# EAGLE design penvmon (EAGLE 9.6.2)
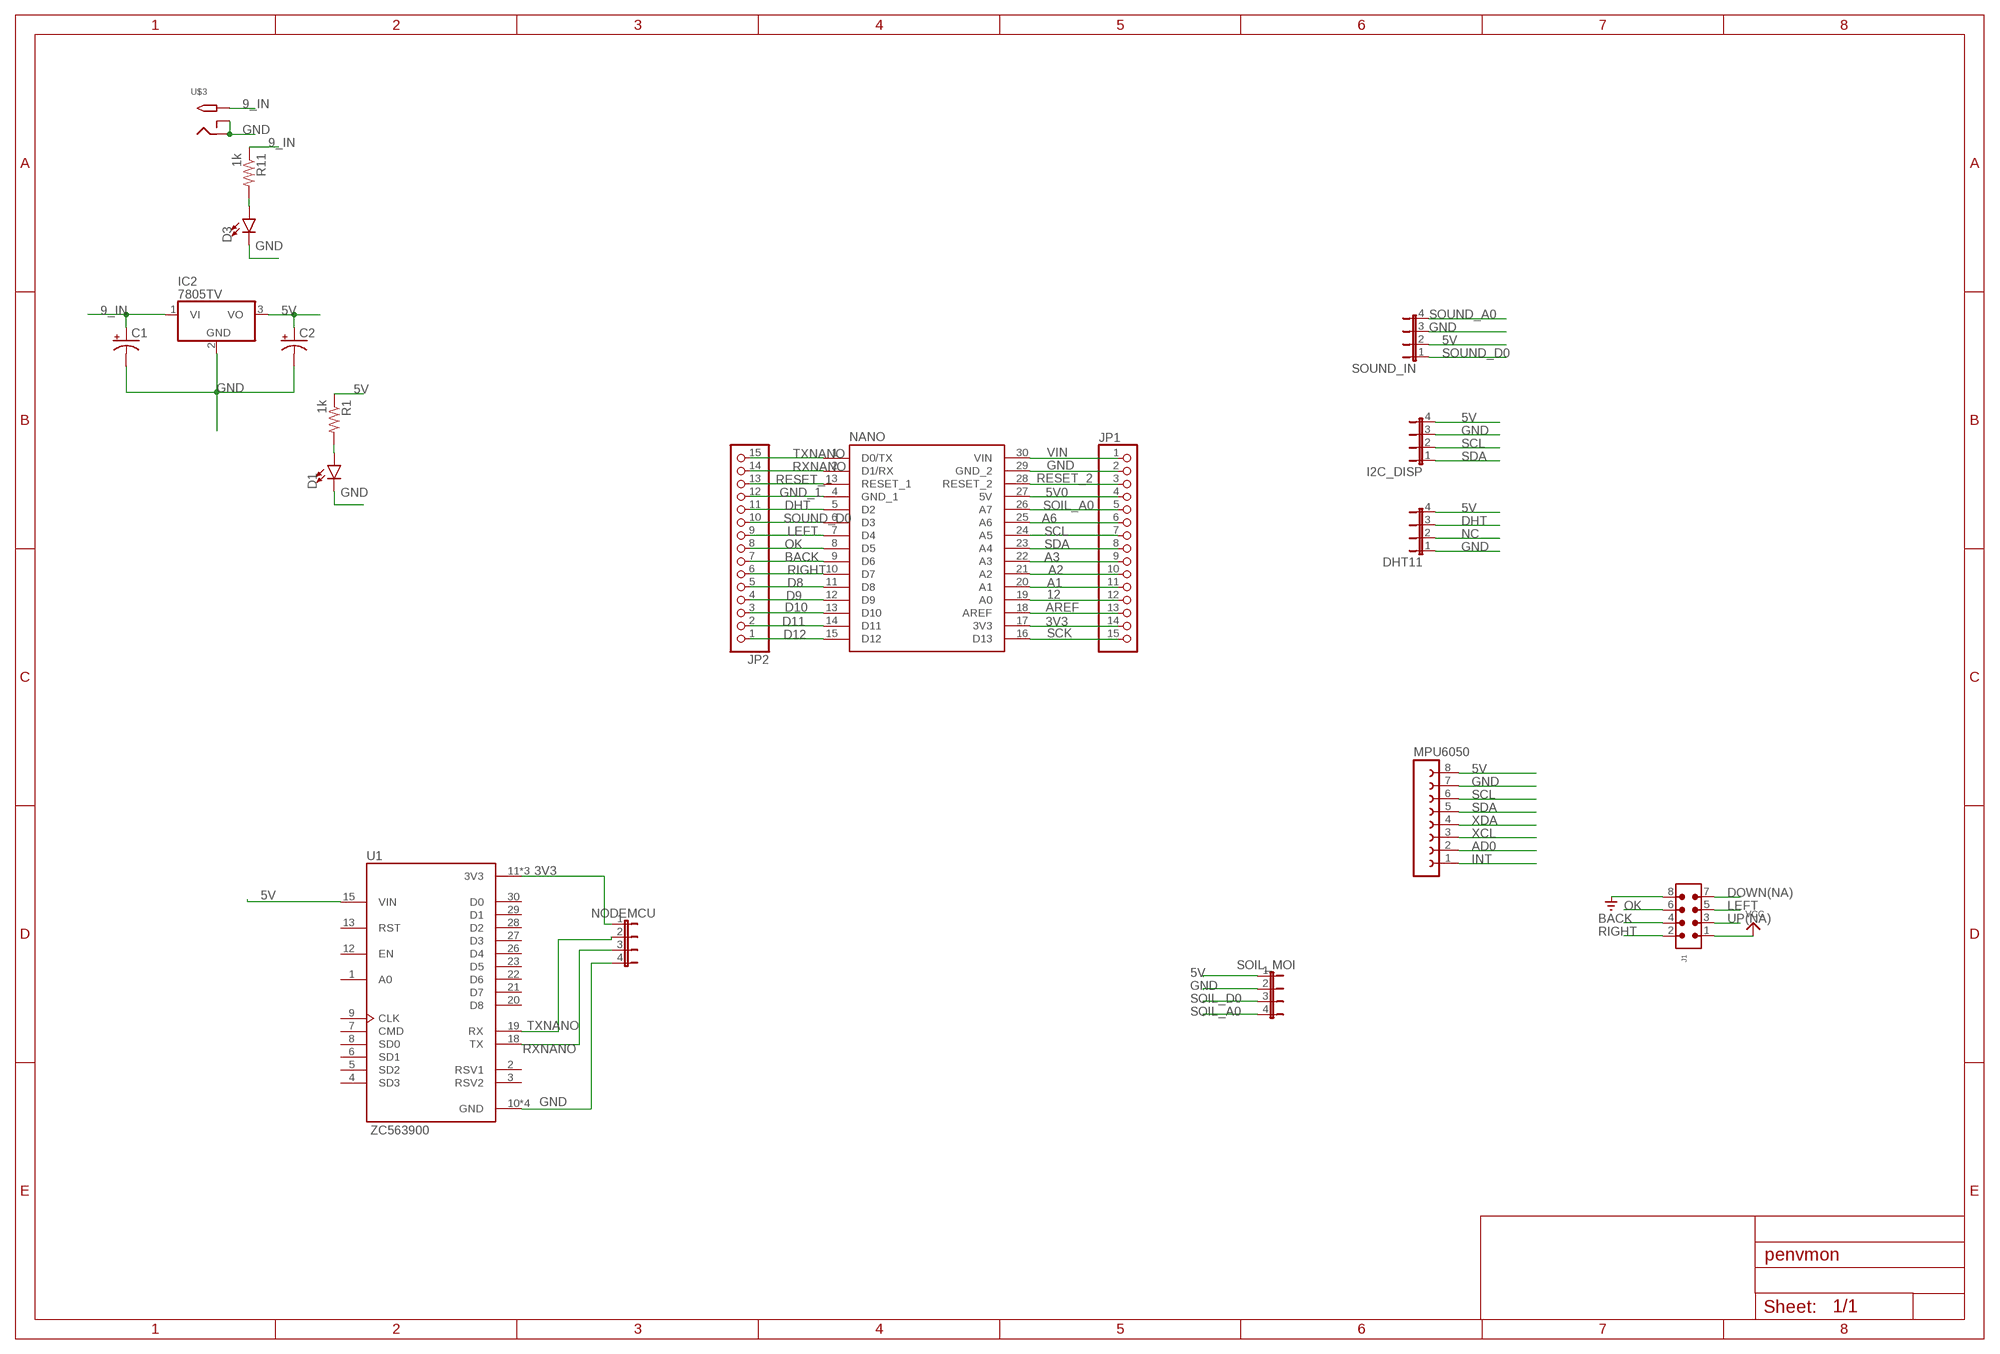
[diagram p0: schematic, sheet 1]

## Parts
C1  CPOL-USE3.5-8  [E3,5-8]
C2  CPOL-USE3.5-8  [E3,5-8]
D1  LED3MM  [LED_3MM]
D3  LED3MM  [LED_3MM]
DHT11  JP4E  [JP4]
I2C_DISP  JP4E  [JP4]
IC2  7805TV  [TO220V]
J1  6120XX21621_61200821621  [61200821621]
JP1  PINHD-1X15  [1X15]
JP2  PINHD-1X15  [1X15]
MPU6050  FE08-1  [FE08]
NANO  A000005  [MODULE_A000005]
NODEMCU  JP4E  [JP4]
R1  1k  R-US_M0805  [M0805]
R11  1k  R-US_M0805  [M0805]
SOIL_MOI  JP4E  [JP4]
SOUND_IN  JP4E  [JP4]
U1  ZC563900  [MODULE_ZC563900]
U$3  2.1MMJACKTHM  [PJ-102A]

## Nets
3V3: JP1.14 NANO.17(3V3) NODEMCU.1 U1.11(3V3) U1.16(3V3) U1.25(3V3)
5V: C2.+ DHT11.4 I2C_DISP.4 IC2.3(VO) MPU6050.8 R1.1 SOIL_MOI.1 SOUND_IN.2 U1.15(VIN)
5V0: JP1.4 NANO.27(5V)
9_IN: C1.+ IC2.1(VI) R11.1 U$3.TIP
12: JP1.12 NANO.19(A0)
A1: JP1.11 NANO.20(A1)
A2: JP1.10 NANO.21(A2)
A3: JP1.9 NANO.22(A3)
A6: JP1.6 NANO.25(A6)
AD0: MPU6050.2
AREF: JP1.13 NANO.18(AREF)
BACK: J1.4 JP2.7 NANO.9(D6)
D8: JP2.5 NANO.11(D8)
D9: JP2.4 NANO.12(D9)
D10: JP2.3 NANO.13(D10)
D11: JP2.2 NANO.14(D11)
D12: JP2.1 NANO.15(D12)
DHT: DHT11.3 JP2.11 NANO.5(D2)
DOWN(NA): J1.7
GND: C1.- C2.- D1.K(C) D3.K(C) DHT11.1 I2C_DISP.3 IC2.2(GND) J1.8 JP1.2 MPU6050.7 NANO.29(GND_2) NODEMCU.4 SOIL_MOI.2 SOUND_IN.3 U1.10(GND) U1.14(GND) U1.17(GND) U1.24(GND) U$3.RING U$3.RING_SW ; supply symbol labelled SUPPLY0_GND_
GND_1: JP2.12 NANO.4(GND_1)
INT: MPU6050.1
LEFT: J1.5 JP2.9 NANO.7(D4)
N$2: D3.A R11.2
N$3: D1.A R1.2
NC: DHT11.2
OK: J1.6 JP2.8 NANO.8(D5)
RESET_1: JP2.13 NANO.3(RESET_1)
RESET_2: JP1.3 NANO.28(RESET_2)
RIGHT: J1.2 JP2.6 NANO.10(D7)
RXNANO: JP2.14 NANO.2(D1/RX) NODEMCU.3 U1.18(TX)
SCK: JP1.15 NANO.16(D13)
SCL: I2C_DISP.2 JP1.7 MPU6050.6 NANO.24(A5)
SDA: I2C_DISP.1 JP1.8 MPU6050.5 NANO.23(A4)
SOIL_A0: JP1.5 NANO.26(A7) SOIL_MOI.4
SOIL_D0: SOIL_MOI.3
SOUND_A0: SOUND_IN.4
SOUND_D0: JP2.10 NANO.6(D3) SOUND_IN.1
TXNANO: JP2.15 NANO.1(D0/TX) NODEMCU.2 U1.19(RX)
UP(NA): J1.3
VCC: J1.1
VIN: JP1.1 NANO.30(VIN)
XCL: MPU6050.3
XDA: MPU6050.4
Unconnected: U1.1(A0) U1.2(RSV1) U1.3(RSV2) U1.4(SD3) U1.5(SD2) U1.6(SD1) U1.7(CMD) U1.8(SD0) U1.9(CLK) U1.12(EN) U1.13(RST) U1.20(D8) U1.21(D7) U1.22(D6) U1.23(D5) U1.26(D4) U1.27(D3) U1.28(D2) U1.29(D1) U1.30(D0)

## Library data of the parts
C1 C2 = adafruit:CPOL-US: POLARIZED CAPACITOR, American symbol
D1 D3 = SparkFun-LED:LED: LED (Generic) Standard schematic elements and footprints for 5mm, 3mm, 1206, and 0603 sized LEDs. Generic LEDs with no color specified.; PROD_ID: DIO-08794
DHT11 I2C_DISP NODEMCU SOIL_MOI SOUND_IN = jumper:JP4E: JUMPER
IC2 = linear:78*: Positive VOLTAGE REGULATOR Source: http://cache.national.com/ds/LM/LM78L05.pdf http://www.fairchildsemi.com/ds/LM/LM7805.pdf
J1 = Wurth_Connectors_WR-BHD:6120XX21621_61200821621: WR-BHD 2.54 mm Male Box Header KIND PROPERTIES: Pitch 2.54 mm Gender:Male MATERIAL PROPERTIES: Insulator Material:PBT Insulator Flammability Rating UL94 V-0 Insulator Color:Black Contact Material :Copper Alloy Contact Plating :Gold Contact Type: Stamped GENERAL INFORMATION: Operating Temperature:-40 °C up to +125 °C Compliance:RoHS Working Voltage: 250 V (AC) Withstanding Voltage:500 V (AC) Contact Resistance: 20 mΩ Insulation Resistance:1000 MΩ CERTIFICATION: UL Approval:E323964 PACKAGING PROPERTIES Packaging :Tray <https://katalog.we-online.com/media/images/v2/o32884v209%20Family_WR-BHD_6120xx21621.jpg> Details see: https://katalog.we-online.com/en/em/BHD_2_54_MALE_BOX_HEADER_6120XX21621 Updated by Yingchun,Shan 2019-10-29 2019 (C) Würth Elektronik; CONTACT-RESISTANCE: 20mOhm; DATASHEET-URL: https://katalog.we-online.com/em/datasheet/61200821621.pdf; GENDER: Male; IR: 3A; L: 17.82mm; MATES: WR-BHD 2.54mm Female IDC Connector with Strain Relief; MOUNT: THT; PACKAGING: Tray; PART-NUMBER: 61200821621; PINS: 8; PITCH: 2.54mm; TOL-R: max.; TYPE: Straight; WORKING-VOLTAGE: 250V(AC)
JP1 JP2 = adafruit:PINHD-1X15: PIN HEADER
MPU6050 = con-lsta:FE08-1: FEMALE HEADER; OC_FARNELL: unknown; OC_NEWARK: unknown
NANO = A000005:A000005: CLOCK SAW OSCILLATOR SEAM7050 T& Check prices <https://pricing.snapeda.com/parts/A000005/Arduino/view-part?ref=eda>; AVAILABILITY: Good; DESCRIPTION: ATmega328 Arduino Nano AVR® ATmega AVR MCU 8-Bit Embedded Evaluation Board; MF: Arduino; MP: A000005; PACKAGE: None; PRICE: None; PURCHASE-URL: https://pricing.snapeda.com/search/part/A000005/?ref=eda
R1 R11 = adafruit:R-US_: RESISTOR, American symbol
U1 = nodemcuZC563900:ZC563900: NodeMcu Lua ESP8266 WIFI Internet of Things Network Development Module Board; AVAILABILITY: Unavailable; DESCRIPTION: NodeMcu Lua ESP8266 WIFI Internet of Things Network Development Module Board; MF: YKS; MP: ZC563900; PACKAGE: None; PRICE: None
U$3 = adafruit:2.1MMJACK: 2.1mm x 5.5mm THM DC jack with internal switch. Digikey part #PJ-102A, 4UCON part #05537 2.1mm x 5.5mm SMT DC jack with internal switch. Digikey part #PJ-002A-SMT, 4UCON part #03267 By microbuilder.eu & adafruit.com

## Board
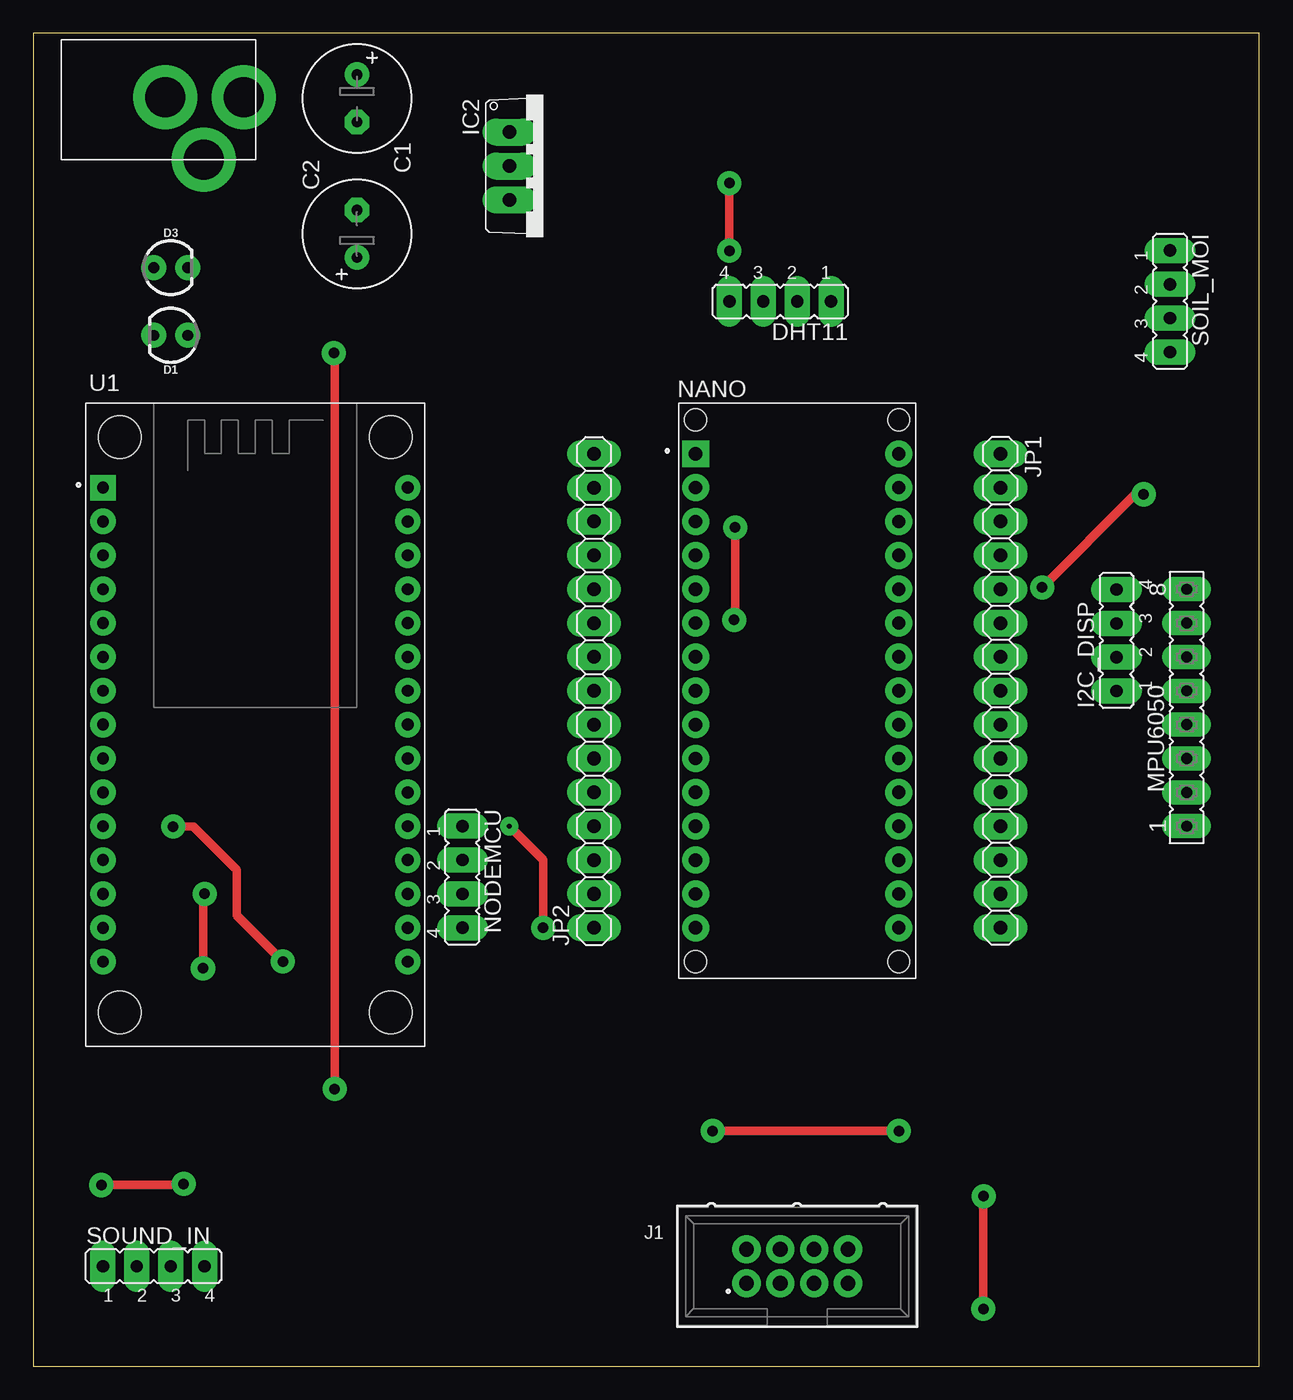
[diagram p1: board, top side]
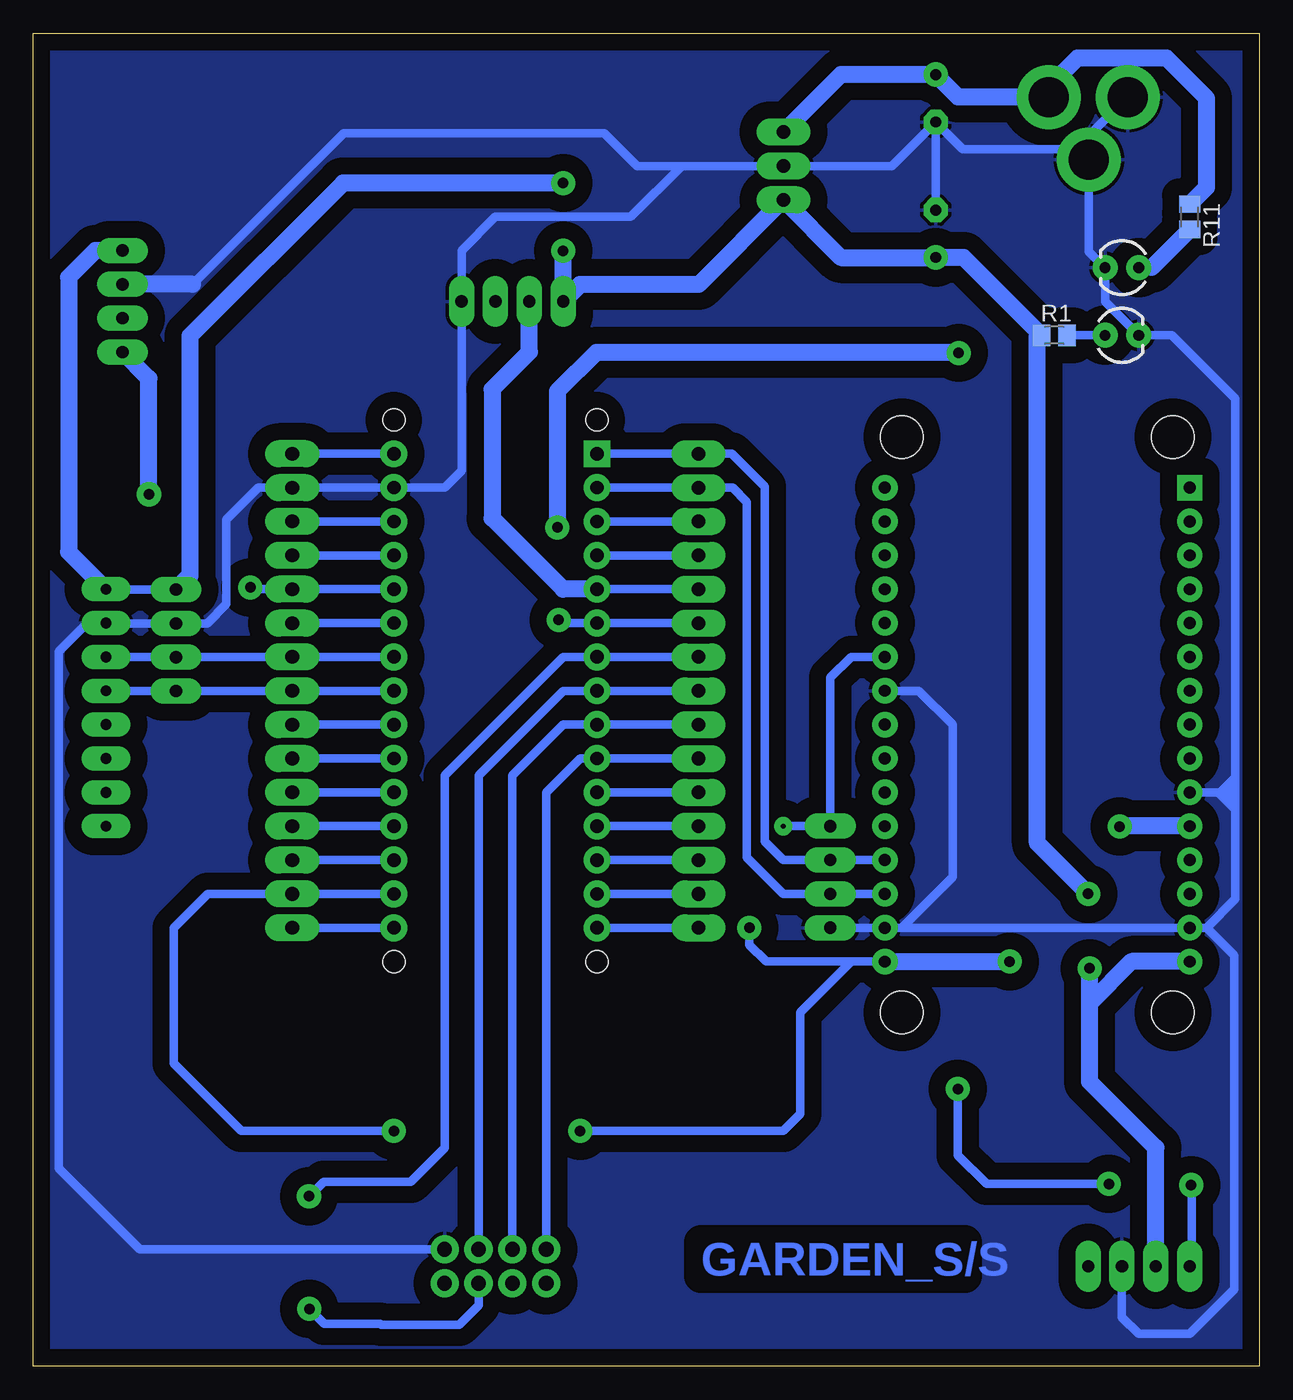
[diagram p2: board, bottom side, seen from below]

Size 91.95 x 100 mm. Coordinates in mm from the lower left corner, seen from the top.
Outline: 0,0 91.95,0 91.95,100 0,100 0,0
Copper layers (1*16): Top 0.035mm / dielectric 1.5mm / Bottom 0.035mm
Design rules "default *": minimum track width 6mil, minimum drill 1mm, track to track 6mil, track to pad 6mil, pad to pad 6mil, via to via 6mil, smd to smd 6mil, copper to edge 40mil, drill to drill 6mil, minimum pad ring 20mil, minimum via ring 20mil, stop-mask expansion 4mil, vias tented up to drill 0mil, thermal gap 10mil

### Footprints (pad centres in the part's own frame; a part is rotated, then mirrored left to right if it is on the bottom)
E3,5-8 = drill 0.813 pad 1.6: + -1.778,0 | drill 0.813 pad 1.6 octagon: - 1.778,0
LED_3MM = drill 0.813 pad 1.88: A -1.27,0; K 1.27,0
JP4 = drill 0.914 long: 1 -3.81,0; 2 -1.27,0; 3 1.27,0; 4 3.81,0
TO220V = drill 1.016 long: 1 -2.54,-2.54; 2 0,-2.54; 3 2.54,-2.54
61200821621 = drill 1.1: 1 -3.81,-1.27; 2 -3.81,1.27; 3 -1.27,-1.27; 4 -1.27,1.27; 5 1.27,-1.27; 6 1.27,1.27; 7 3.81,-1.27; 8 3.81,1.27
1X15 = drill 1.016 long: 1 -17.78,0; 2 -15.24,0; 3 -12.7,0; 4 -10.16,0; 5 -7.62,0; 6 -5.08,0; 7 -2.54,0; 8 0,0; 9 2.54,0; 10 5.08,0; 11 7.62,0; 12 10.16,0; 13 12.7,0; 14 15.24,0; 15 17.78,0
FE08 = drill 0.813 long: 1 -8.89,0; 2 -6.35,0; 3 -3.81,0; 4 -1.27,0; 5 1.27,0; 6 3.81,0; 7 6.35,0; 8 8.89,0
MODULE_A000005 = drill 1 square: 1 -7.62,17.78 | drill 1: 2 -7.62,15.24; 3 -7.62,12.7; 4 -7.62,10.16; 5 -7.62,7.62; 6 -7.62,5.08; 7 -7.62,2.54; 8 -7.62,0; 9 -7.62,-2.54; 10 -7.62,-5.08; 11 -7.62,-7.62; 12 -7.62,-10.16; 13 -7.62,-12.7; 14 -7.62,-15.24; 15 -7.62,-17.78; 16 7.62,-17.78; 17 7.62,-15.24; 18 7.62,-12.7; 19 7.62,-10.16; 20 7.62,-7.62; 21 7.62,-5.08; 22 7.62,-2.54; 23 7.62,0; 24 7.62,2.54; 25 7.62,5.08; 26 7.62,7.62; 27 7.62,10.16; 28 7.62,12.7; 29 7.62,15.24; 30 7.62,17.78 | hole 1.651: -7.62,-20.32; 7.62,-20.32; -7.62,20.32; 7.62,20.32
M0805 = smd 1.3 x 1.6: 1 -0.95,0; 2 0.95,0
MODULE_ZC563900 = drill 0.889 pad 1.753 square: 1 -11.43,17.78 | drill 0.889 pad 1.753: 2 -11.43,15.24; 3 -11.43,12.7; 4 -11.43,10.16; 5 -11.43,7.62; 6 -11.43,5.08; 7 -11.43,2.54; 8 -11.43,0; 9 -11.43,-2.54; 10 -11.43,-5.08; 11 -11.43,-7.62; 12 -11.43,-10.16; 13 -11.43,-12.7; 14 -11.43,-15.24; 15 -11.43,-17.78; 16 11.43,-17.78; 17 11.43,-15.24; 18 11.43,-12.7; 19 11.43,-10.16; 20 11.43,-7.62; 21 11.43,-5.08; 22 11.43,-2.54; 23 11.43,0; 24 11.43,2.54; 25 11.43,5.08; 26 11.43,7.62; 27 11.43,10.16; 28 11.43,12.7; 29 11.43,15.24; 30 11.43,17.78 | hole 3.2: -10.16,21.59; 10.16,21.59; 10.16,-21.59; -10.16,-21.59
PJ-102A = drill 3 pad 4.8: RING 0.1,-3.39; RING_SW -4.6,-6.29; TIP 0.1,-9.29

### Placement (x,y rotation side)
C1  24.27,95.12 270 top
C2  24.27,84.96 90 top
D1  10.3,77.34 180 top
D3  10.3,82.42 0 top
DHT11  56.02,79.88 180 top
I2C_DISP  81.24,54.46 90 top
IC2  38.24,90.04 270 top
J1  57.29,7.49 0 top
JP1  72.53,50.67 270 top
JP2  42.05,50.67 90 top
MPU6050  86.5,49.4 90 top
NANO  57.29,50.67 0 top
NODEMCU  32.18,36.7 270 top
R1  15.38,77.34 0 bottom
R11  5.22,86.23 270 bottom
SOIL_MOI  85.26,79.9 270 top
SOUND_IN  9.03,7.49 0 top
U1  16.65,48.13 0 top
U$3  6.49,95.12 90 top

### Tracks (layer width: path | path; a pad name or v marks a point on that pad's centre or on a via)
3V3  (via drill 0.35, 0.79)
  Top 0.635: v50.94,17.65 v64.91,17.65 | v38.24,32.89 38.24,37.97 v35.7,40.51 | v18.72,30.35 15.25,33.82 15.25,37.24 12,40.49 v10.48,40.49
  Bottom 0.635: NANO.17 JP1.14 78.88,35.43 81.42,32.89 81.42,22.73 76.34,17.65 v64.91,17.65 | 30.62,30.35 34.43,26.54 34.43,18.92 35.7,17.65 v50.94,17.65 | U1.16 30.62,30.35 | U1.25 30.62,53.21 32.18,51.65 NODEMCU.1 v35.7,40.51 | 30.62,30.35 36.97,30.35 38.24,31.62 v38.24,32.89 | 18.8,30.35 18.77,30.33 18.75,30.33 v18.72,30.35 | 10.45,40.51 v10.48,40.49
  Bottom 1.27: U1.16 18.8,30.35 | U1.11 10.45,40.51
5V  (via drill 0.79)
  Top 0.635: v52.21,83.69 v52.21,88.77 | v12.72,29.86 12.72,35.32 v12.84,35.43
  Bottom 0.635: R1.1 16.49,77.5 16.65,77.34 | MPU6050.8 86.47,58.27 I2C_DISP.4
  Bottom 1.27: 16.49,77.5 22.17,83.19 C2.+ 31.38,83.19 IC2.3 42.05,81.15 50.94,81.15 DHT11.4 v52.21,83.69 | v52.21,88.77 68.72,88.77 80.2,77.29 80.2,59.31 I2C_DISP.4 | SOUND_IN.2 7.76,16.38 12.72,21.35 12.72,27.22 | 12.72,27.22 v12.72,29.86 | v12.84,35.43 16.65,39.24 16.65,77.34 | SOIL_MOI.1 87.29,83.71 89.29,81.7 89.29,61.09 MPU6050.8 | U1.15 9.59,30.35 12.72,27.22
5V0
  Bottom 0.635: NANO.27 JP1.4
9_IN
  Bottom 1.27: R11.1 3.95,88.45 3.95,95.12 6.96,98.13 13.64,98.13 15.78,95.99 U$3.TIP 22.59,95.22 C1.+ 31.38,96.9 IC2.1
12
  Bottom 0.635: NANO.19 JP1.12
A1
  Bottom 0.635: NANO.20 JP1.11
A2
  Bottom 0.635: NANO.21 JP1.10
A3
  Bottom 0.635: NANO.22 JP1.9
A6
  Bottom 0.635: NANO.25 JP1.6
AREF
  Bottom 0.635: NANO.18 JP1.13
BACK
  Bottom 0.635: JP2.7 NANO.9 52.21,48.13 56.02,44.32 J1.4
D8
  Bottom 0.635: NANO.11 JP2.5
D9
  Bottom 0.635: NANO.12 JP2.4
D10
  Bottom 0.635: NANO.13 JP2.3
D11
  Bottom 0.635: NANO.14 JP2.2
D12
  Bottom 0.635: NANO.15 JP2.1
DHT
  Bottom 0.635: NANO.5 JP2.11
  Bottom 1.27: NANO.5 52.21,58.29 57.54,63.63 57.54,73.3 54.75,76.1 DHT11.3
GND
  Bottom 0.635: U$3.RING 12.78,92.32 U$3.RING_SW | U$3.RING_SW 12.78,83.63 D3.K 11.57,79.88 D1.K 6.55,77.34 1.79,72.58 1.79,44.18 | U$3.RING_SW 13.57,91.31 22.24,91.31 C1.- | C2.- C1.- | C1.- 27.57,90.04 IC2.2 43.32,90.04 | 43.32,90.04 47.13,86.23 57.29,86.23 59.83,83.69 DHT11.1 59.83,67.18 61.1,65.91 NANO.29 JP1.2 75.07,65.91 77.47,63.51 77.47,57.16 78.91,55.73 I2C_DISP.3 86.47,55.73 MPU6050.7 87.9,55.75 90.04,53.61 90.04,14.85 83.96,8.76 J1.8 63.64,8.76 | U1.17 NODEMCU.4 | SOUND_IN.3 10.3,3.68 9.03,2.41 5.22,2.41 1.88,5.75 1.88,30.82 3.95,32.89 | 3.95,32.89 U1.14 U1.17 | 3.95,32.89 1.79,35.05 1.79,41.77 | 1.79,41.77 1.79,43.05 | U1.17 26.81,32.89 23,36.7 23,48.13 25.54,50.67 U1.24 | 1.79,43.05 1.79,44.18 | 3.07,43.05 2.47,42.45 | 2.47,42.45 1.79,41.77 | 1.79,43.05 2.21,43.05 | 2.21,43.05 2.92,43.05 | 3.07,43.05 U1.10 | 2.47,42.45 2.21,42.71 2.21,43.05 | 3.07,43.05 2.92,43.05 | 2.92,43.05 1.79,44.18 | 43.32,90.04 46.67,90.04 49.12,92.49 68.67,92.49 80,81.17
  Bottom 1.27: 80,81.17 SOIL_MOI.2
  pour Bottom (isolate 1.27): -0.03,99.96 -0.03,0 91.97,0 91.97,99.96
GND_1
  Bottom 0.635: NANO.4 JP2.12
LEFT  (via drill 0.79)
  Top 0.635: v71.27,12.75 71.25,12.72 v71.25,4.29
  Bottom 0.635: JP2.9 NANO.7 52.21,53.21 61.1,44.32 61.1,16.38 63.64,13.84 70.18,13.84 v71.27,12.75 | J1.5 58.56,4.56 60.02,3.1 65.85,3.1 65.93,3.17 70.13,3.17 v71.25,4.29
N$2
  Bottom 0.635: 8.08,82.42 D3.A
  Bottom 1.27: R11.2 8.08,82.42
N$3
  Bottom 0.635: D1.A R1.2
OK
  Bottom 0.635: JP2.8 NANO.8 52.21,50.67 58.56,44.32 J1.6
RESET_1
  Bottom 0.635: NANO.3 JP2.13
RESET_2
  Bottom 0.635: NANO.28 JP1.3
RIGHT
  Bottom 0.635: JP2.6 NANO.10 50.94,45.59 53.48,43.05 J1.2
RXNANO
  Bottom 0.635: NANO.2 JP2.14 39.51,65.91 38.43,64.83 38.43,38.16 35.7,35.43 NODEMCU.3 U1.18
SCK
  Bottom 0.635: NANO.16 JP1.15
SCL
  Bottom 0.635: NANO.24 JP1.7 72.56,53.19 I2C_DISP.2 86.47,53.19 MPU6050.6
SDA
  Bottom 0.635: NANO.23 JP1.8 72.56,50.65 I2C_DISP.1 86.47,50.65 MPU6050.5
SOIL_A0  (via drill 0.79, 0.8)
  Top 0.635: v75.67,58.43 82.65,65.42 v83.27,65.42
  Bottom 0.635: NANO.26 JP1.5 75.53,58.29 v75.67,58.43
  Bottom 1.27: v83.27,65.42 83.27,74.11 SOIL_MOI.4
SOUND_D0  (via drill 0.79)
  Top 0.635: v11.28,13.68 11.21,13.61 5.13,13.61 v5.11,13.59 | v22.54,76.02 22.61,75.96 v22.61,20.8 | v52.64,62.93 52.64,56.07 v52.55,55.98
  Bottom 0.635: JP2.10 NANO.6 52.32,55.75 v52.55,55.98 | SOUND_IN.1 5.08,7.63 5.08,13.56 v5.11,13.59 | v11.28,13.68 20.46,13.68 22.61,15.82 v22.61,20.8 | v22.54,76.02 22.59,76.07
  Bottom 1.27: 22.59,76.07 49.71,76.07 52.64,73.14 v52.64,62.93
TXNANO
  Bottom 0.635: NANO.1 JP2.15 39.57,68.45 37.11,65.99 37.11,39.38 35.7,37.97 NODEMCU.2 U1.19
VIN
  Bottom 0.635: NANO.30 JP1.1

### Text on the board
Bottom: GARDEN_S/S